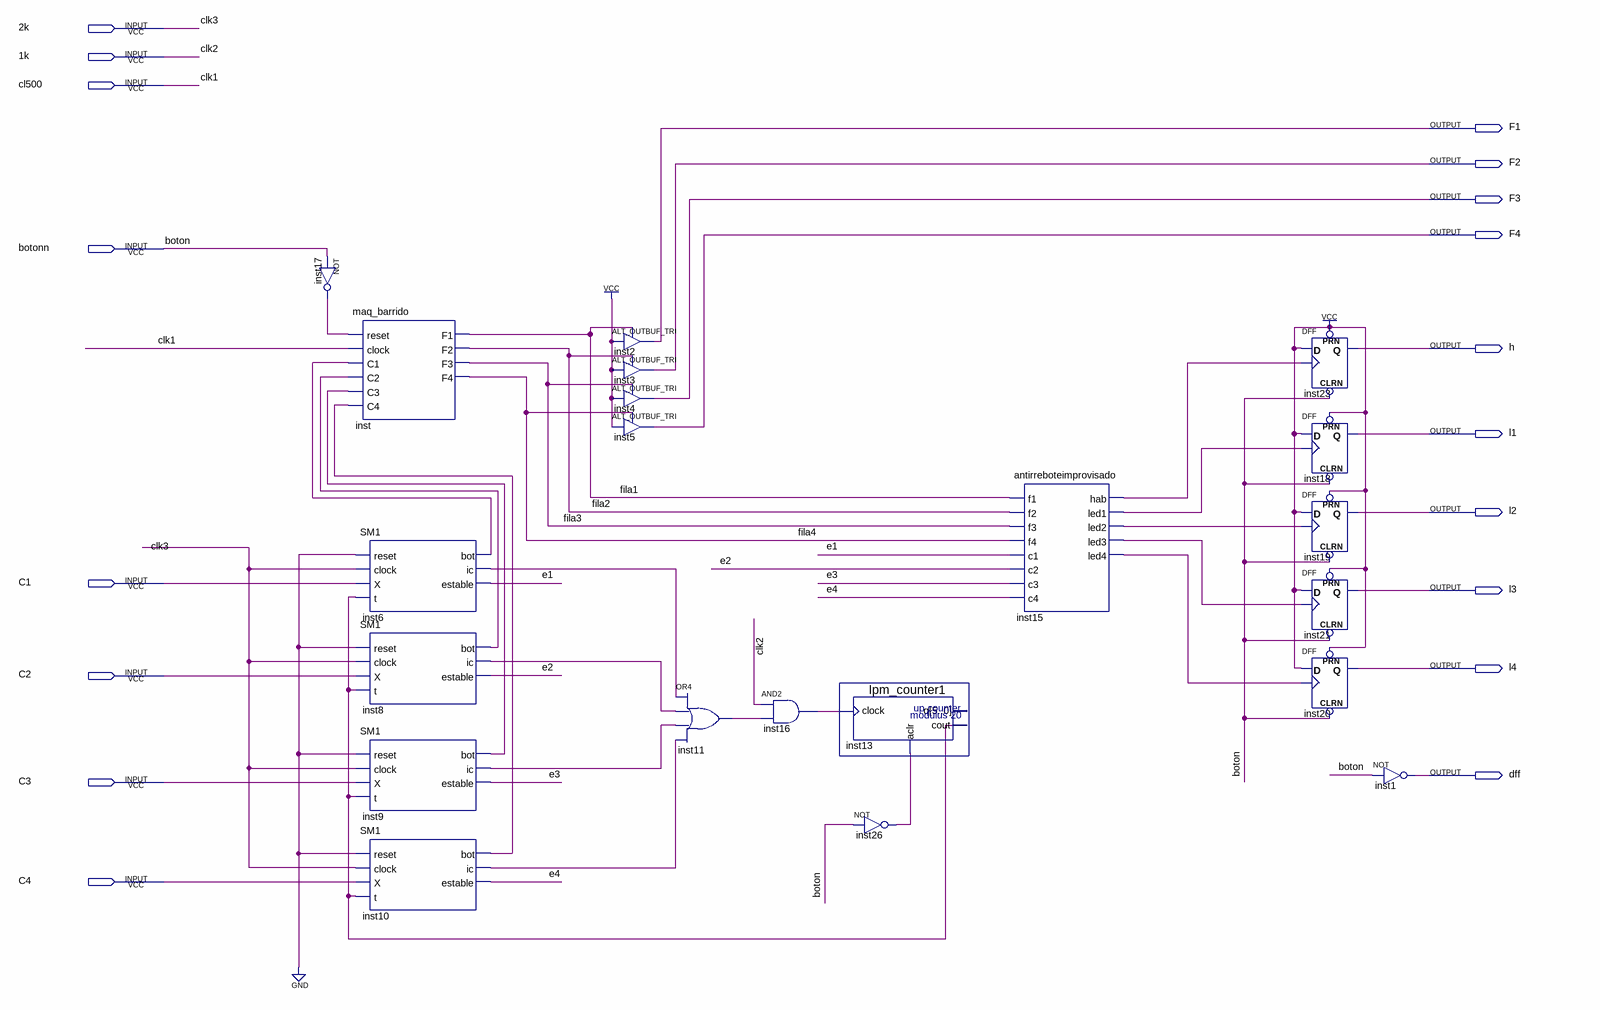
[diagram p0: schematic sheet]
// Quartus schematic tecladover2.bdf as structural Verilog: 21 symbols, 18 pins
module tecladover2 (
  input  \2k ,
  input  \1k ,
  input  cl500,
  input  botonn,
  input  C1,
  input  C2,
  input  C3,
  input  C4,
  output F1,
  output F2,
  output F3,
  output F4,
  output h,
  output l1,
  output l2,
  output l3,
  output l4,
  output dff
);

  wire e1, e2, e3, e4, fila1, fila2, fila3, fila4, inst6_bot, inst6_ic, inst8_bot, inst8_ic, inst9_bot,
       inst9_ic, inst10_bot, inst10_ic, inst11_out, inst13_cout, inst15_hab, inst15_led1, inst15_led2,
       inst15_led3, inst15_led4, inst16_out, inst17_out, inst26_out;

  not inst17 (inst17_out, botonn);
  maq_barrido inst (
    .reset(inst17_out), .clock(cl500), .C1(inst6_bot), .C2(inst8_bot), .C3(inst9_bot), .C4(inst10_bot),
    .F1(fila1), .F2(fila2), .F3(fila3), .F4(fila4));
  SM1 inst6 (.reset(1'b0), .clock(\2k ), .X(C1), .t(inst13_cout), .bot(inst6_bot), .ic(inst6_ic), .estable(e1));
  SM1 inst8 (.reset(1'b0), .clock(\2k ), .X(C2), .t(inst13_cout), .bot(inst8_bot), .ic(inst8_ic), .estable(e2));
  SM1 inst9 (.reset(1'b0), .clock(\2k ), .X(C3), .t(inst13_cout), .bot(inst9_bot), .ic(inst9_ic), .estable(e3));
  SM1 inst10 (.reset(1'b0), .clock(\2k ), .X(C4), .t(inst13_cout), .bot(inst10_bot), .ic(inst10_ic), .estable(e4));
  ALT_OUTBUF_TRI inst2 (.i(1'b1), .oe(fila1), .o(F1));
  ALT_OUTBUF_TRI inst3 (.i(1'b1), .oe(fila2), .o(F2));
  ALT_OUTBUF_TRI inst4 (.i(1'b1), .oe(fila3), .o(F3));
  ALT_OUTBUF_TRI inst5 (.i(1'b1), .oe(fila4), .o(F4));
  or inst11 (inst11_out, inst6_ic, inst8_ic, inst9_ic, inst10_ic);
  and inst16 (inst16_out, \1k , inst11_out);
  lpm_counter1 inst13 (.clock(inst16_out), .aclr(inst26_out), .cout(inst13_cout));  // open: q
  not inst26 (inst26_out, botonn);
  antirreboteimprovisado inst15 (
    .f1(fila1), .f2(fila2), .f3(fila3), .f4(fila4), .c1(e1), .c2(e2), .c3(e3), .c4(e4), .hab(inst15_hab),
    .led1(inst15_led1), .led2(inst15_led2), .led3(inst15_led3), .led4(inst15_led4));
  DFF inst23 (.CLRN(botonn), .CLK(inst15_hab), .D(1'b1), .PRN(1'b1), .Q(h));
  DFF inst18 (.CLRN(botonn), .CLK(inst15_led1), .D(1'b1), .PRN(1'b1), .Q(l1));
  DFF inst19 (.CLRN(botonn), .CLK(inst15_led2), .D(1'b1), .PRN(1'b1), .Q(l2));
  DFF inst21 (.CLRN(botonn), .CLK(inst15_led3), .D(1'b1), .PRN(1'b1), .Q(l3));
  DFF inst20 (.CLRN(botonn), .CLK(inst15_led4), .D(1'b1), .PRN(1'b1), .Q(l4));
  not inst1 (dff, botonn);

  // Other names for the same wires on the sheet: boton = botonn; clk1 = cl500; clk2 = \1k ; clk3 = \2k 
endmodule
